# Altium schematic sheet POWER_Management.SchDoc: =ProjectName
size 420 x 297 mm; Author: T.P.; CompanyName: WUT; DrawnBy: T.P.; Organization: WUT ISE; Address1: Warsaw Univeristy of Technology; Address2: Nowowiejska 15/19; DocumentNumber: 24; Revision: 0.9; SheetNumber: 24; SheetTotal: 36; EDA_Number: ARTIQ; Projet: ARTIQ/SINARA; ModifiedBy: -; CreateDate: XX/XX/XXXX; CheckedDate: -; Title2: POWER_Management.SchDoc; DivGrp: ISE; Designer: G.K. and T.P.; ModifiedDate: -; ProjectName: ADC/DAC MEZZANINE
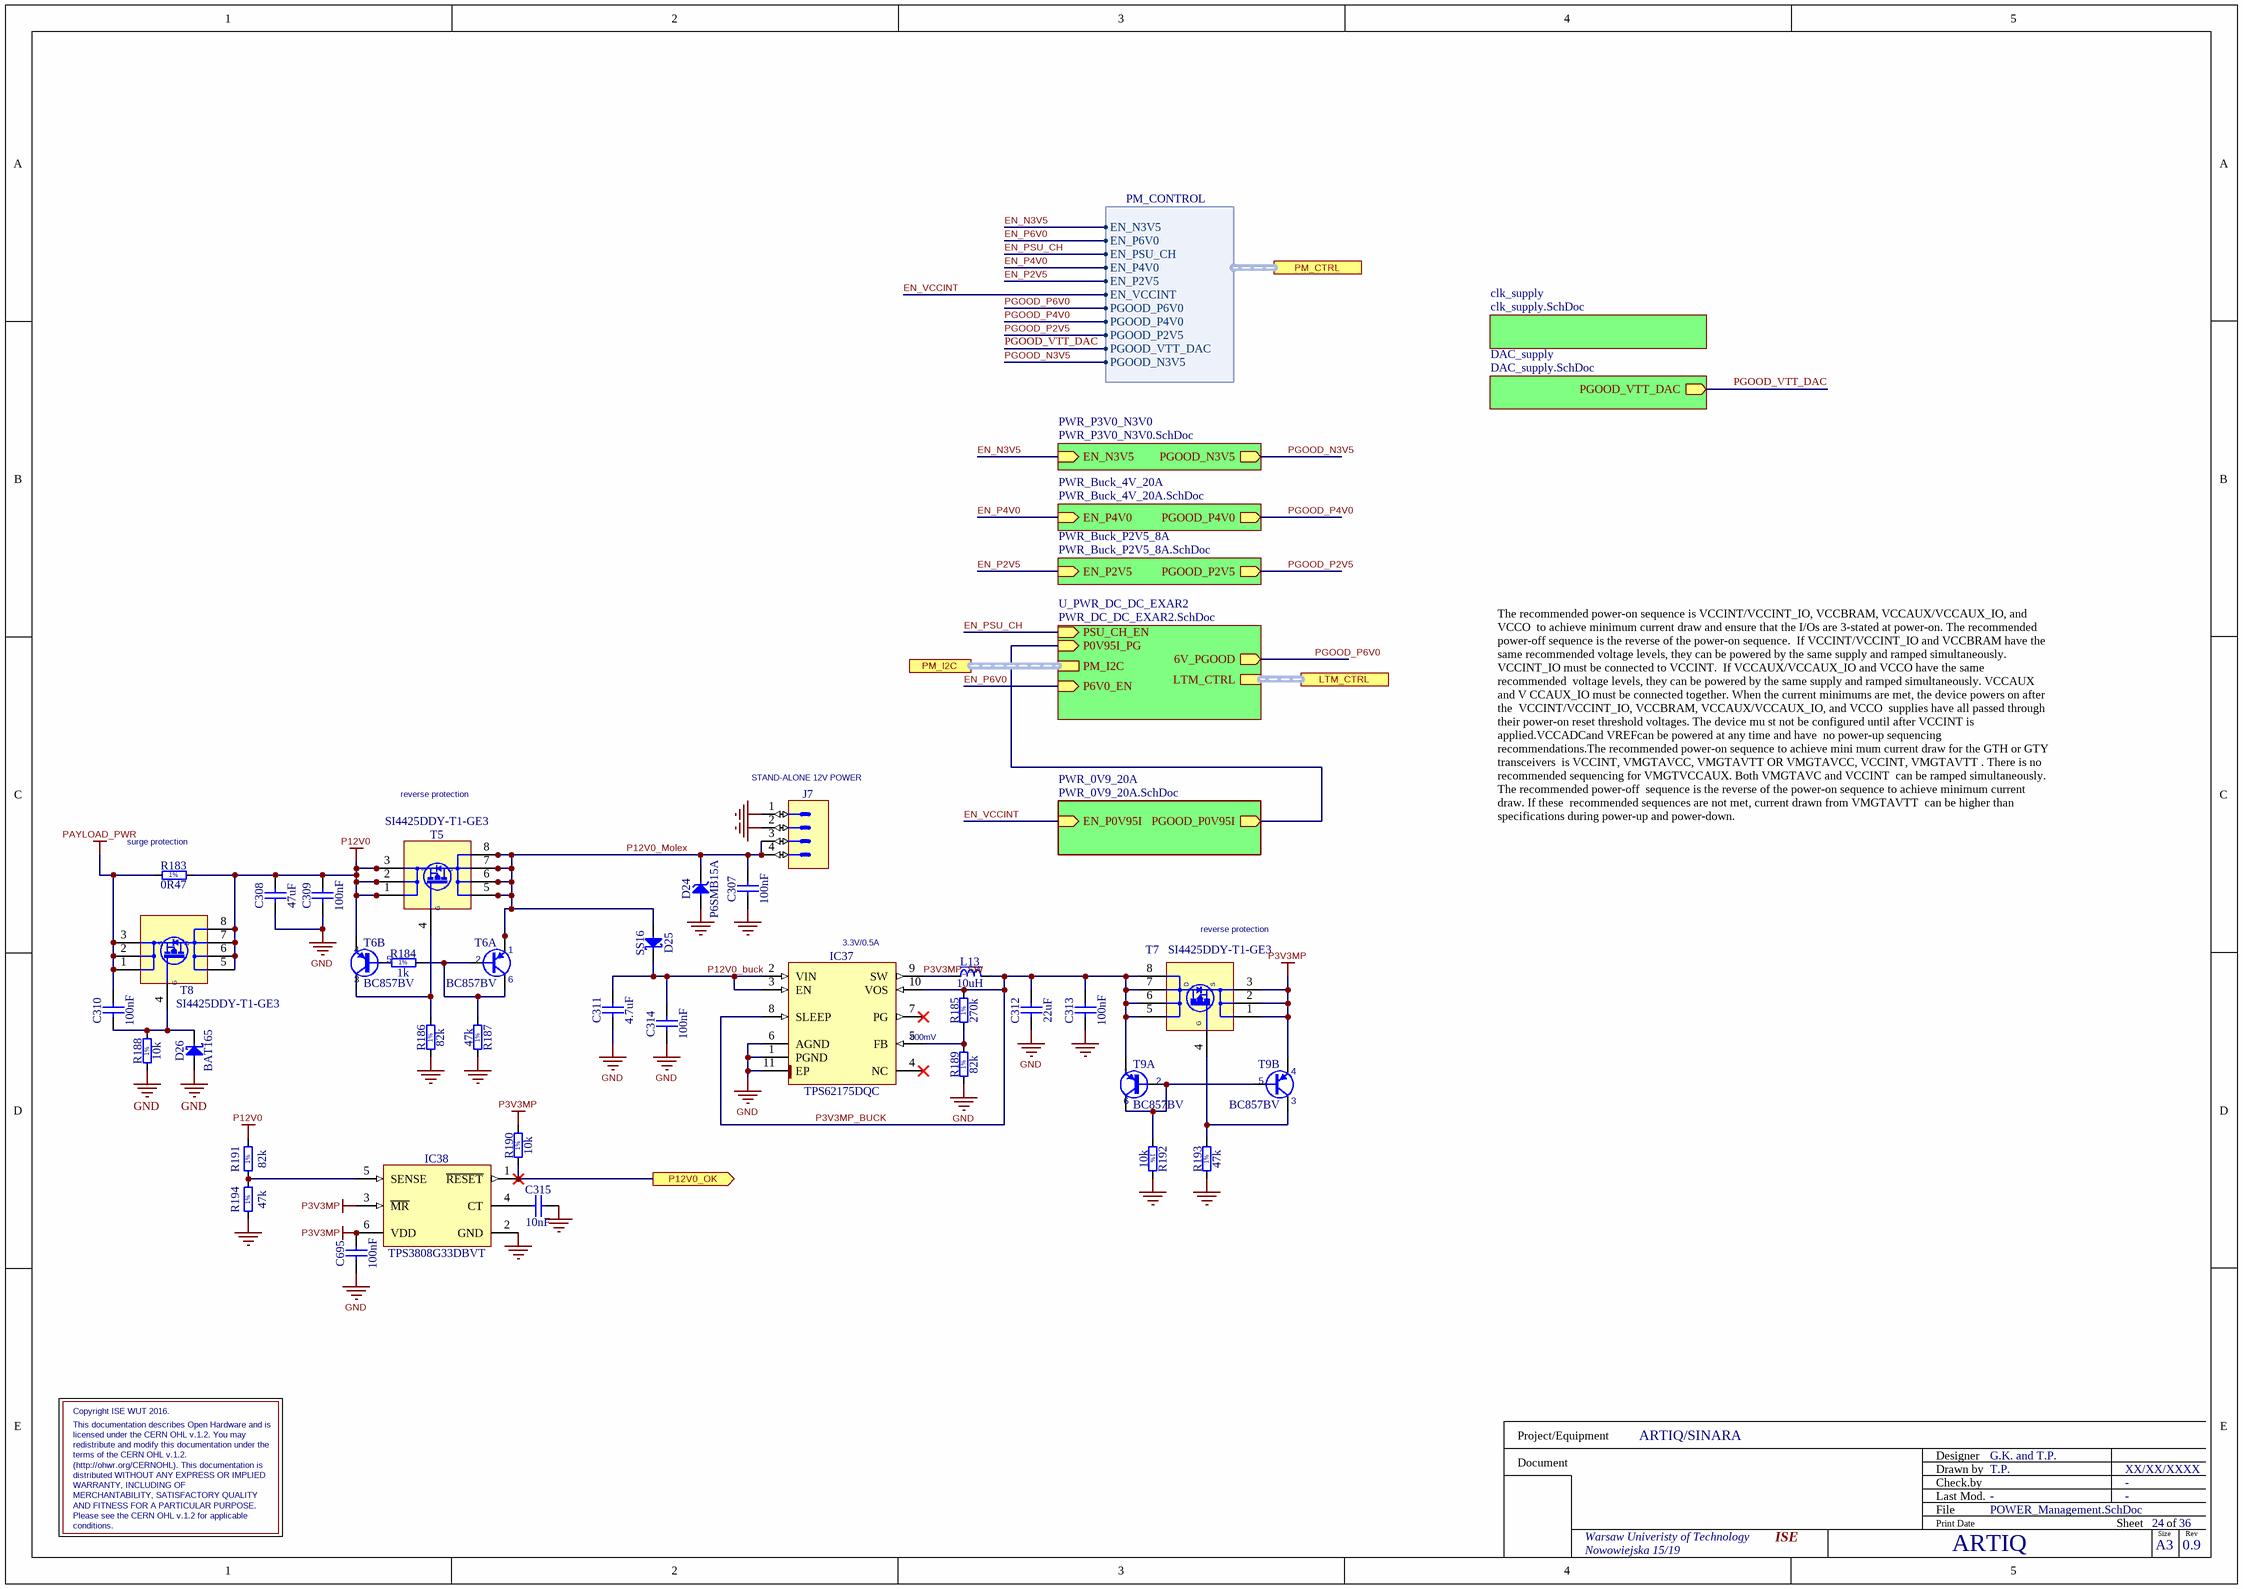
[diagram p0: POWER_Management.SchDoc]

## Parts
C307  100nF  [CAPC1005X55N]
C308  47uF  [CAPC3216X180N]
C309  100nF  [CAPC1005X55N]
C310  100nF  [CAPC1005X55N]
C311  4.7uF  [CAPC1709X95N]
C312  22uF  [CAPC2012X135N]
C313  100nF  [CAPC1005X55N]
C314  100nF  [CAPC1005X55N]
C315  10nF  [CAPC1005X55N]
C695  100nF  [CAPC1005X55N]
D24  P6SMB15A  [DIOM5436X261N]
D25  SS16  [DIOM5127X229N]
D26  BAT165  [SOD2512X110N]
IC37  TPS62175DQC  [SON50P200X300X80-11N-R94X250]
IC38  TPS3808G33DBVT  [SOT95P280X145-6N]
J7  Mini-Fit Jr.™  [MOLEX_39-28-1043]  (value not drawn)
L13  10uH  [IND_MURATA-PS_8400]
R183  0R47  [RESC3216X65N]
R184  1k  [RESC1005X40N]
R185  270k  [RESC1005X40N]
R186  82k  [RESC1005X40N]
R187  47k  [RESC1005X40N]
R188  10k  [RESC1005X40N]
R189  82k  [RESC1005X40N]
R190  10k  [RESC1005X40N]
R191  82k  [RESC1005X40N]
R192  10k  [RESC1005X40N]
R193  47k  [RESC1005X40N]
R194  47k  [RESC1005X40N]
T5  SI4425DDY-T1-GE3  [SOIC127P600X175-8N]
T6  BC857BV  [SOTFL50P160X60-6N]  (parts A,B of 2)
T7  SI4425DDY-T1-GE3  [SOIC127P600X175-8N]
T8  SI4425DDY-T1-GE3  [SOIC127P600X175-8N]
T9  BC857BV  [SOTFL50P160X60-6N]  (parts A,B of 2)

## Sub-sheets
clk_supply = clk_supply.SchDoc: no entries
DAC_supply = DAC_supply.SchDoc: PGOOD_VTT_DAC (out)
PWR_0V9_20A = PWR_0V9_20A.SchDoc: PGOOD_P0V95I (out), EN_P0V95I (in)  | CmpIndex: 17; SymIndex: 784
PWR_Buck_4V_20A = PWR_Buck_4V_20A.SchDoc: EN_P4V0 (in), PGOOD_P4V0 (out)
PWR_Buck_P2V5_8A = PWR_Buck_P2V5_8A.SchDoc: PGOOD_P2V5 (out), EN_P2V5 (in)
PWR_P3V0_N3V0 = PWR_P3V0_N3V0.SchDoc: PGOOD_N3V5 (out), EN_N3V5 (in)
U_PWR_DC_DC_EXAR2 = PWR_DC_DC_EXAR2.SchDoc: P0V95I_PG (in), PSU_CH_EN (in), LTM_CTRL (harness LTM_CTRL), PM_I2C (harness I2C), 6V_PGOOD (out), P6V0_EN (in)

## Ports
LTM_CTRL (harness LTM_CTRL), P12V0_OK (out), PM_CTRL (harness PM_CONTROL), PM_I2C (harness I2C)

## Harnesses
PM_CONTROL: EN_P6V0, EN_PSU_CH, EN_VCCINT, PGOOD_P6V0, EN_P2V5, EN_P4V0, PGOOD_P4V0, PGOOD_P2V5, PGOOD_VTT_DAC, EN_N3V5, PGOOD_N3V5

## Nets
GND: C307.1 C308.1 C309.1 C311.1 C312.1 C313.1 C314.1 C315.1 C695.1 D24.2(A) D26.2(A) IC37.1(PGND) IC37.6(AGND) IC37.11(EP) IC38.2(GND) J7.1 J7.2 R186.1 R187.1 R188.1 R189.1 R192.2 R193.1 R194.1
P3V3MP: C695.2 IC38.3(~{MR}) IC38.6(VDD) R190.2 T7.1(S) T7.2(S) T7.3(S) T9.4(E)
P12V0: C308.2 C309.2 R183.2 R191.2 T5.1(S) T5.2(S) T5.3(S) T6.4(E) T8.5(D) T8.6(D) T8.7(D) T8.8(D)
PAYLOAD_PWR: C310.2 R183.1 T8.1(S) T8.2(S) T8.3(S)
EN_N3V5: sheet PWR_P3V0_N3V0/EN_N3V5, port PM_CTRL.EN_N3V5
EN_P2V5: sheet PWR_Buck_P2V5_8A/EN_P2V5, port PM_CTRL.EN_P2V5
EN_P4V0: sheet PWR_Buck_4V_20A/EN_P4V0, port PM_CTRL.EN_P4V0
EN_P6V0: sheet U_PWR_DC_DC_EXAR2/P6V0_EN, port PM_CTRL.EN_P6V0
EN_PSU_CH: sheet U_PWR_DC_DC_EXAR2/PSU_CH_EN, port PM_CTRL.EN_PSU_CH
EN_VCCINT: sheet PWR_0V9_20A/EN_P0V95I, port PM_CTRL.EN_VCCINT
P3V3MP_BUCK: C312.2 C313.2 IC37.8(SLEEP) IC37.10(VOS) L13.2 R185.2 T7.5(D) T7.6(D) T7.7(D) T7.8(D) T9.1(E)
P3V3MP_SW: IC37.9(SW) L13.1
P12V0_buck: C311.2 C314.2 D25.1(C) IC37.2(VIN) IC37.3(EN)
P12V0_Molex: C307.2 D24.1(C) D25.2(A) J7.3 J7.4 T5.5(D) T5.6(D) T5.7(D) T5.8(D) T6.1(E)
P12V0_OK: IC38.1(~{RESET}) R190.1 ; port P12V0_OK
PGOOD_N3V5: sheet PWR_P3V0_N3V0/PGOOD_N3V5, port PM_CTRL.PGOOD_N3V5
PGOOD_P2V5: sheet PWR_Buck_P2V5_8A/PGOOD_P2V5, port PM_CTRL.PGOOD_P2V5
PGOOD_P4V0: sheet PWR_Buck_4V_20A/PGOOD_P4V0, port PM_CTRL.PGOOD_P4V0
PGOOD_P6V0: sheet U_PWR_DC_DC_EXAR2/6V_PGOOD, port PM_CTRL.PGOOD_P6V0
PGOOD_VTT_DAC: sheet DAC_supply/PGOOD_VTT_DAC, port PM_CTRL.PGOOD_VTT_DAC
NetC310_1: C310.1 D26.1(C) R188.2 T8.4(S)
NetC315_2: C315.2 IC38.4(CT)
NetIC37_5: IC37.5(FB) R185.1 R189.2
NetIC38_5: IC38.5(SENSE) R191.1 R194.2
NetR184_1: R184.1 T6.5(B)
NetR184_2: R184.2 R187.2 T6.2(B) T6.6(C)
NetR186_2: R186.2 T5.4(S) T6.3(C)
NetR192_1: R192.1 T9.2(B) T9.5(B) T9.6(C)
NetR193_2: R193.2 T7.4(S) T9.3(C)
(unnamed): sheet PWR_0V9_20A/PGOOD_P0V95I, sheet U_PWR_DC_DC_EXAR2/P0V95I_PG

Not connected (* = marked no-connect by the designer): IC37 4(NC)* 7(PG)*

## Buses and harness runs
harness port LTM_CTRL = sheet U_PWR_DC_DC_EXAR2/LTM_CTRL
harness port PM_I2C = sheet U_PWR_DC_DC_EXAR2/PM_I2C

## Notes on the sheet
- reverse protection
- (near J7) STAND-ALONE 12V POWER
- (near R183) surge protection
- The recommended power-on sequence is VCCINT/VCCINT_IO, VCCBRAM, VCCAUX/VCCAUX_IO, and VCCO  to achieve minimum current draw and ensure that the I/Os are 3-stated at power-on. The recommended  power-off sequence is the reverse of the power-on sequence.  If VCCINT/VCCINT_IO and VCCBRAM have the  same recommended voltage levels, they can be powered by the same supply and ramped simultaneously.  VCCINT_IO must be connected to VCCINT.  If VCCAUX/VCCAUX_IO and VCCO have the same recommended  voltage levels, they can be powered by the same supply and ramped simultaneously. VCCAUX and V CCAUX_IO must be connected together. When the current minimums are met, the device powers on after the  VCCINT/VCCINT_IO, VCCBRAM, VCCAUX/VCCAUX_IO, and VCCO  supplies have all passed through their power-on reset threshold voltages. The device mu st not be configured until after VCCINT is applied.VCCADCand VREFcan be powered at any time and have  no power-up sequencing recommendations.The recommended power-on sequence to achieve mini mum current draw for the GTH or GTY transceivers  is VCCINT, VMGTAVCC, VMGTAVTT OR VMGTAVCC, VCCINT, VMGTAVTT . There is no recommended sequencing for VMGTVCCAUX. Both VMGTAVC and VCCINT  can be ramped simultaneously. The recommended power-off  sequence is the reverse of the power-on sequence to achieve minimum current draw. If these  recommended sequences are not met, current drawn from VMGTAVTT  can be higher than specifications during power-up and power-down.
- (near T7) reverse protection
- (near IC37) 3.3V/0.5A
- (near IC37) 800mV
- Copyright ISE WUT 2016.
- This documentation describes Open Hardware and is
- distributed WITHOUT ANY EXPRESS OR IMPLIED
- terms of the CERN OHL v.1.2.
- (http://ohwr.org/CERNOHL). This documentation is
- redistribute and modify this documentation under the
- licensed under the CERN OHL v.1.2. You may
- WARRANTY, INCLUDING OF
- AND FITNESS FOR A PARTICULAR PURPOSE.
- conditions.
- Please see the CERN OHL v.1.2 for applicable
- MERCHANTABILITY, SATISFACTORY QUALITY
- Project/Equipment
- Document
- Designer
- Drawn by
- Check.by
- File
- Last Mod.
- Print Date
- Sheet
- Size
- A3
- of
- Rev
- (in symbol R0402_1K_1%_0.0625W_100PPM) 1%
- (in symbol R0402_10K_1%_0.0625W_100PPM) 1%
- (in symbol R0402_47K_1%_0.0625W_100PPM) 1%
- (in symbol R0402_82K_1%_0.0625W_100PPM) 1%
- (in symbol R0402_270K_1%_0.0625W_100PPM) 1%
- (in symbol R1206_0R47_1%_0.5W_600PPM) 1%
- (in symbol SI4425DDY-T1-GE3) G

## Library data of the parts
C307 C309 C310 C313 C314 C695 = CC0402_100NF_16V_10%_X5R: Non-polarised capacitor; Manufacturer: GENERIC; Part Description: SMD Multilayer Chip Ceramic Capacitor; Manufacturer1 Part Number: GRM155R61C104KA88D; Tolerance: ±10%; Voltage: 16V; TC: X5R; Manufacturer Part Number: CC0402_100NF_16V_10%_X5R; Part Number: CC0402_100NF_16V_10%_X5R; Value: 100nF; Component Kind: Standard; Component Type: Standard; Pin Count: 2; Status: None; Case: 0402; Mounted: Yes; Socket: No; SMD: Yes; Sense: No; Manufacturer1 Example: MURATA; Manufacturer1 ComponentHeight: 0.55mm; HelpURL: \\cern.ch\dfs\Applications\Altium\Datasheets\CC0402_X5R_MURATA_GRM.pdf; Author: CERN DEM JLC; CreateDate: 10.12.2013; LatestRevisionDate: 10.12.2013
C308 = CC1206_47UF_25V_20%_X5R: Non-polarised capacitor; Manufacturer: GENERIC; Part Description: SMD Multilayer Chip Ceramic Capacitor; Manufacturer1 Part Number: C3216X5R1E476M160AC; Tolerance: ±20%; Voltage: 25V; TC: X5R; Manufacturer Part Number: CC1206_47UF_25V_20%_X5R; Part Number: CC1206_47UF_25V_20%_X5R; Value: 47uF; Component Kind: Standard; Component Type: Standard; Pin Count: 2; Status: None; Case: 1206; Mounted: Yes; Socket: No; SMD: Yes; Sense: No; Manufacturer1 Example: TDK; Manufacturer1 ComponentHeight: 1.8mm; HelpURL: \\cern.ch\dfs\Applications\Altium\Datasheets\CC1206_X5R_TDK_C.pdf; Author: CERN DEM JLC; CreateDate: 20.11.2013; LatestRevisionDate: 14.03.2017
C311 = CC0603_4.7UF_16V_10%_X5R: Non-polarised capacitor; Manufacturer: GENERIC; Part Description: SMD Multilayer Chip Ceramic Capacitor; Manufacturer1 Part Number: EMK107ABJ475KA-T; Tolerance: ±10%; Voltage: 16V; TC: X5R; Manufacturer Part Number: CC0603_4.7UF_16V_10%_X5R; Part Number: CC0603_4.7UF_16V_10%_X5R; Value: 4.7uF; Component Kind: Standard; Component Type: Standard; Pin Count: 2; Status: None; Case: 0603; Mounted: Yes; Socket: No; SMD: Yes; Sense: No; Manufacturer1 Example: TAIYO YUDEN; Manufacturer1 ComponentHeight: 0.95mm; HelpURL: \\cern.ch\dfs\Applications\Altium\Datasheets\CC0603_X7R_TAIYO-YUDEN_HIGH-VALUE.pdf; Author: CERN DEM JLC; CreateDate: 16.12.2013; LatestRevisionDate: 16.09.2014
C312 = CC0805_22UF_16V_10%_X5R: Non-polarised capacitor; Manufacturer: GENERIC; Part Description: SMD Multilayer Chip Ceramic Capacitor; Manufacturer1 Part Number: C2012X5R1C226KT; Tolerance: ±10%; Voltage: 16V; TC: X5R; Manufacturer Part Number: CC0805_22UF_16V_10%_X5R; Part Number: CC0805_22UF_16V_10%_X5R; Value: 22uF; Component Kind: Standard; Component Type: Standard; Pin Count: 2; Status: Preferred; Case: 0805; Mounted: Yes; Socket: No; SMD: Yes; Sense: No; Manufacturer1 Example: TDK; Manufacturer1 ComponentHeight: 1.35mm; HelpURL: \\cern.ch\dfs\Applications\Altium\Datasheets\CC0805_X5R_TDK_C.pdf; Author: CERN DEM JLC; CreateDate: 25.10.2012; LatestRevisionDate: 25.10.2012
C315 = CC0402_10NF_16V_10%_X7R: Non-polarised capacitor; Manufacturer: GENERIC; Part Description: SMD Multilayer Chip Ceramic Capacitor; Manufacturer1 Part Number: 223878715636; Tolerance: ±10%; Voltage: 16V; TC: X7R; Manufacturer Part Number: CC0402_10NF_16V_10%_X7R; Part Number: CC0402_10NF_16V_10%_X7R; Value: 10nF; Component Kind: Standard; Component Type: Standard; Pin Count: 2; Status: Not Recommended; Case: 0402; Mounted: Yes; Socket: No; SMD: Yes; Sense: No; Manufacturer1 Example: PHYCOMP; Manufacturer1 ComponentHeight: 0.55mm; HelpURL: \\cern.ch\dfs\Applications\Altium\Datasheets\CC0402_X7R_PHYCOMP.pdf; Author: CERN DEM JLC; CreateDate: 03.12.2007; LatestRevisionDate: 03.12.2007
D24 = P6SMB15A: Transient Voltage Suppressor Diode (Uni-Directional); Part Description: Uni-directional Transient Voltage Suppressor (TVS) Diode; Manufacturer: LITTELFUSE; Voltage: 15V; Power: 600W; PressFit: No; Bonding: No; Part Number: P6SMB15A; Component Kind: Standard; Component Type: Standard; Device: P6SMB15A; PackageDescription: DO-214-AA/SMB Diode, Molded Body; 5.40mm L X 3.62mm W X 2.61mm H, IPC Medium Density; Manufacturer Part Number: P6SMB15A; Pin Count: 2; Case: SMB; Mounted: Yes; Socket: No; SMD: Yes; Sense: No; ComponentHeight: 2.61mm; HelpURL: \\cern.ch\dfs\Applications\Altium\Datasheets\P6SMB15A.pdf; Author: CERN DEM JLC; CreateDate: 12.07.2017; LatestRevisionDate: 12.07.2017
D25 = SS16: Schottky Diode; Manufacturer: VISHAY GENERAL SEMICONDUCTOR; Part Description: Surface Mount Schottky Barrier Rectifier; Voltage: 60V; Power: 1A; PressFit: No; Bonding: No; Manufacturer Part Number: SS16; PackageDescription: DO-214-AC Molded Diode, Body 5.1x2.7mm, IPC Medium Density; Part Number: SS16; Component Kind: Standard; Component Type: Standard; Device: SS16; Pin Count: 2; Case: DO-214AC; Mounted: Yes; Socket: No; SMD: Yes; Sense: No; ComponentHeight: 2.29mm; HelpURL: \\cern.ch\dfs\Applications\Altium\Datasheets\SS16.pdf; Author: CERN DEM JLC; CreateDate: 15.07.2008; LatestRevisionDate: 23.08.2010
D26 = BAT165: Schottky Diode; Manufacturer: INFINEON; Part Description: Medium Power AF Schottky Diode; Voltage: 40V; Power: 750mA; PressFit: No; Bonding: No; Manufacturer Part Number: BAT165; PackageDescription: Small Outline Diode (SOD-323), 1.70mm W X 1.25mm L X 1.10mm H body,  IPC Medium Density; Part Number: BAT165; Component Kind: Standard; Component Type: Standard; Device: BAT165; Pin Count: 2; Case: SOD323; Mounted: Yes; Socket: No; SMD: Yes; Sense: No; ComponentHeight: 1.1mm; HelpURL: \\cern.ch\dfs\Applications\Altium\Datasheets\BAT165.pdf; Author: CERN DEM JLC; CreateDate: 12.11.2014; LatestRevisionDate: 12.11.2014
IC37 = TPS62175DQC: 4.75-28VDC to 1-6VDC, 500mA Step-Down Converter With Sleep Mode; Manufacturer: TEXAS INSTRUMENTS; PressFit: No; Bonding: No; Manufacturer Part Number: TPS62175DQC; PackageDescription: SON, 10-Leads, Body 2x3mm, Pitch 0.5mm, Thermal Pad 0.94x2.5mm, IPC Medium Density; Part Description: 4.75-28VDC to 1-6VDC, 500mA Step-Down Converter With Sleep Mode; Part Number: TPS62175DQC; Component Kind: Standard; Component Type: Standard; Device: TPS62175DQC; Pin Count: 11; Case: SON10; Mounted: Yes; Socket: No; SMD: Yes; Sense: No; ComponentHeight: 0.8mm; HelpURL: \\cern.ch\dfs\Applications\Altium\Datasheets\TPS62175DQC.pdf; Author: CERN DEM JMW; CreateDate: 11.08.2015; LatestRevisionDate: 11.08.2015
IC38 = TPS3808G33DBVT: Low Quiescent Current, Programmable-Delay Supervisory Circuit; Manufacturer: TEXAS INSTRUMENTS; Part Description: 3.3V, Low Quiescent Current, Programmable-Delay Supervisory Circuit; PressFit: No; Bonding: No; Manufacturer Part Number: TPS3808G33DBVT; PackageDescription: SOT23, 6-Leads, Body 1.6x3.0mm, Pitch 0.95mm, IPC Medium Density; Part Number: TPS3808G33DBVT; Component Kind: Standard; Component Type: Standard; Device: TPS3808G33DBVT; Pin Count: 6; Case: SOT23-6; Mounted: Yes; Socket: No; SMD: Yes; Sense: No; ComponentHeight: 1.45mm; Author: CERN DEM JLC; HelpURL: \\cern.ch\dfs\Applications\Altium\Datasheets\TPS3808G33DBVT.pdf; CreateDate: 05.11.2013; LatestRevisionDate: 05.11.2013
J7 = MOLEX_39-28-1043: Connector 4 Male; Manufacturer: MOLEX; Part Description: 4.20mm (.165") Pitch Mini-Fit Jr.™ Header, Dual Row, Vertical, without Snap-in Plastic Peg PCB Lock, 4 Circuits; PressFit: No; Manufacturer Part Number: 39-28-1043; Part Number: MOLEX_39-28-1043; Component Kind: Standard; Component Type: Standard; Pin Count: 4; Family: Mini-Fit Jr.™; Mounted: Yes; Socket: No; SMD: No; Sense: No; Status: None; ComponentHeight: 13.1mm; HelpURL: \\cern.ch\dfs\Applications\Altium\Datasheets\MOLEX_39-28-1043.pdf; Author: CERN DEM JLC; CreateDate: 12.03.2009; LatestRevisionDate: 06.03.2012
L13 = IND_10UH_10%_MURATA-PS_8400: Inductor With Core; Manufacturer Part Number: 84103C; Manufacturer: MURATA POWER SOLUTIONS; Part Description: Miniature Surface Mount Power Inductor (8400 Series); Tolerance: ±10%; Power: 950mA; Resistance: 0.24R; Part Number: IND_10UH_10%_MURATA-PS_8400; Value: 10uH; Component Kind: Standard; Component Type: Standard; Pin Count: 2; Status: None; Mounted: Yes; Socket: No; SMD: Yes; Sense: No; ComponentHeight: 2.9mm; HelpURL: \\cern.ch\dfs\Applications\Altium\Datasheets\IND_MURATA-PS_8400.pdf; Author: CERN DEM JLC; CreateDate: 02.07.2012; LatestRevisionDate: 02.07.2012
R183 = R1206_0R47_1%_0.5W_600PPM: Resistor - 1%; Part Description: Low Ohmique High Power Chip Resistor; Manufacturer: YAGEO PHYCOMP; Manufacturer Part Number: RL1206FR-7W0R47  (35051914707); Power: 0.5W; TC: ±600ppm/°C; PressFit: No; Part Number: R1206_0R47_1%_0.5W_600PPM; Component Kind: Standard; Component Type: Standard; Pin Count: 2; Value: 0R47; Status: Not Recommended; Tolerance: ±1%; Case: 1206; Mounted: Yes; Sense: No; Socket: No; SMD: Yes; ComponentHeight: 0.65mm; HelpURL: \\cern.ch\dfs\Applications\Altium\Datasheets\R1206_PHYCOMP_LRC02P.pdf; Author: CERN DEM JLC; CreateDate: 22.04.2010; LatestRevisionDate: 22.04.2010
R184 = R0402_1K_1%_0.0625W_100PPM: Resistor - 1%; Manufacturer: GENERIC; Part Description: General Purpose Thick Film Chip Resistor; Manufacturer1 Part Number: 232270671002L; TC: ±100ppm/°C; PressFit: No; Manufacturer Part Number: R0402_1K_1%_0.0625W_100PPM; Part Number: R0402_1K_1%_0.0625W_100PPM; Tolerance: ±1%; Value: 1k; Component Kind: Standard; Component Type: Standard; Pin Count: 2; Status: Not Recommended; Power: 0.0625W; Case: 0402; Mounted: Yes; Sense: No; Socket: No; SMD: Yes; Manufacturer1 Example: YAGEO PHYCOMP; Manufacturer1 ComponentHeight: 0.4mm; HelpURL: \\cern.ch\dfs\Applications\Altium\Datasheets\R0402_Phycomp_RC0402.pdf; Author: CERN DEM JLC; CreateDate: 03.12.2007; LatestRevisionDate: 17.10.2012
R185 = R0402_270K_1%_0.0625W_100PPM: Resistor - 1%; Manufacturer: GENERIC; Part Description: General Purpose Thick Film Chip Resistor; Manufacturer1 Part Number: 232270672704L; TC: ±100ppm/°C; PressFit: No; Manufacturer Part Number: R0402_270K_1%_0.0625W_100PPM; Part Number: R0402_270K_1%_0.0625W_100PPM; Tolerance: ±1%; Value: 270k; Component Kind: Standard; Component Type: Standard; Pin Count: 2; Status: Not Recommended; Power: 0.0625W; Case: 0402; Mounted: Yes; Sense: No; Socket: No; SMD: Yes; Manufacturer1 Example: YAGEO PHYCOMP; Manufacturer1 ComponentHeight: 0.4mm; HelpURL: \\cern.ch\dfs\Applications\Altium\Datasheets\R0402_Phycomp_RC0402.pdf; Author: CERN DEM JLC; CreateDate: 03.12.2007; LatestRevisionDate: 17.10.2012
R186 R189 R191 = R0402_82K_1%_0.0625W_100PPM: Resistor - 1%; Manufacturer: GENERIC; Part Description: General Purpose Thick Film Chip Resistor; Manufacturer1 Part Number: 232270678203L; TC: ±100ppm/°C; PressFit: No; Manufacturer Part Number: R0402_82K_1%_0.0625W_100PPM; Part Number: R0402_82K_1%_0.0625W_100PPM; Tolerance: ±1%; Value: 82k; Component Kind: Standard; Component Type: Standard; Pin Count: 2; Status: Not Recommended; Power: 0.0625W; Case: 0402; Mounted: Yes; Sense: No; Socket: No; SMD: Yes; Manufacturer1 Example: YAGEO PHYCOMP; Manufacturer1 ComponentHeight: 0.4mm; HelpURL: \\cern.ch\dfs\Applications\Altium\Datasheets\R0402_Phycomp_RC0402.pdf; Author: CERN DEM JLC; CreateDate: 03.12.2007; LatestRevisionDate: 17.10.2012
R187 R193 R194 = R0402_47K_1%_0.0625W_100PPM: Resistor - 1%; Manufacturer: GENERIC; Part Description: General Purpose Thick Film Chip Resistor; Manufacturer1 Part Number: 232270675103L; TC: ±100ppm/°C; PressFit: No; Manufacturer Part Number: R0402_47K_1%_0.0625W_100PPM; Part Number: R0402_47K_1%_0.0625W_100PPM; Tolerance: ±1%; Value: 47k; Component Kind: Standard; Component Type: Standard; Pin Count: 2; Status: Not Recommended; Power: 0.0625W; Case: 0402; Mounted: Yes; Sense: No; Socket: No; SMD: Yes; Manufacturer1 Example: YAGEO PHYCOMP; Manufacturer1 ComponentHeight: 0.4mm; HelpURL: \\cern.ch\dfs\Applications\Altium\Datasheets\R0402_Phycomp_RC0402.pdf; Author: CERN DEM JLC; CreateDate: 03.12.2007; LatestRevisionDate: 17.10.2012
R188 R190 R192 = R0402_10K_1%_0.0625W_100PPM: Resistor - 1%; Manufacturer: GENERIC; Part Description: General Purpose Thick Film Chip Resistor; Manufacturer1 Part Number: 232270671003L; TC: ±100ppm/°C; PressFit: No; Manufacturer Part Number: R0402_10K_1%_0.0625W_100PPM; Part Number: R0402_10K_1%_0.0625W_100PPM; Tolerance: ±1%; Value: 10k; Component Kind: Standard; Component Type: Standard; Pin Count: 2; Status: Not Recommended; Power: 0.0625W; Case: 0402; Mounted: Yes; Sense: No; Socket: No; SMD: Yes; Manufacturer1 Example: YAGEO PHYCOMP; Manufacturer1 ComponentHeight: 0.4mm; HelpURL: \\cern.ch\dfs\Applications\Altium\Datasheets\R0402_Phycomp_RC0402.pdf; Author: CERN DEM JLC; CreateDate: 03.12.2007; LatestRevisionDate: 17.10.2012
T5 T7 T8 = SI4425DDY-T1-GE3: -30V -19.7A P-Channel MOSFET; Manufacturer: VISHAY SILICONIX; PressFit: No; Bonding: No; Manufacturer Part Number: SI4425DDY-T1-GE3; PackageDescription: SOIC 8, Pitch 1.27mm - Body 4x5mm, IPC Medium Density; Part Description: -30V -19.7A P-Channel MOSFET; Part Number: SI4425DDY-T1-GE3; Component Kind: Standard; Component Type: Standard; Device: SI4425DDY-T1-GE3; Pin Count: 8; Case: SOIC8; Mounted: Yes; Socket: No; SMD: Yes; Sense: No; ComponentHeight: 1.75mm; HelpURL: \\cern.ch\dfs\Applications\Altium\Datasheets\SI4425DDY-T1-GE3.pdf; Author: CERN DEM MR; CreateDate: 05.10.2016; LatestRevisionDate: 05.10.2016
T6 T9 = BC857BV: 45V, 100mA PNP General Purpose Double Transistor; Manufacturer: NXP SEMICONDUCTORS; Part Description: -45V -100mA PNP General Purpose Double Transistor; PressFit: No; Bonding: No; Manufacturer Part Number: BC857BV; PackageDescription: SOTFL (SOT666), 0.50mm, Pitch; 6 Pin, 1.20mm W X 1.60mm L X 0.60mm H Body, IPC Medium Density; Part Number: BC857BV; Component Kind: Standard; Component Type: Standard; Device: BC857BV; Pin Count: 6; Case: SOT666; Mounted: Yes; Socket: No; SMD: Yes; Sense: No; ComponentHeight: 0.6mm; HelpURL: \\cern.ch\dfs\Applications\Altium\Datasheets\BC857BV.pdf; Author: CERN DEM JLC; CreateDate: 01.12.2011; LatestRevisionDate: 01.12.2011